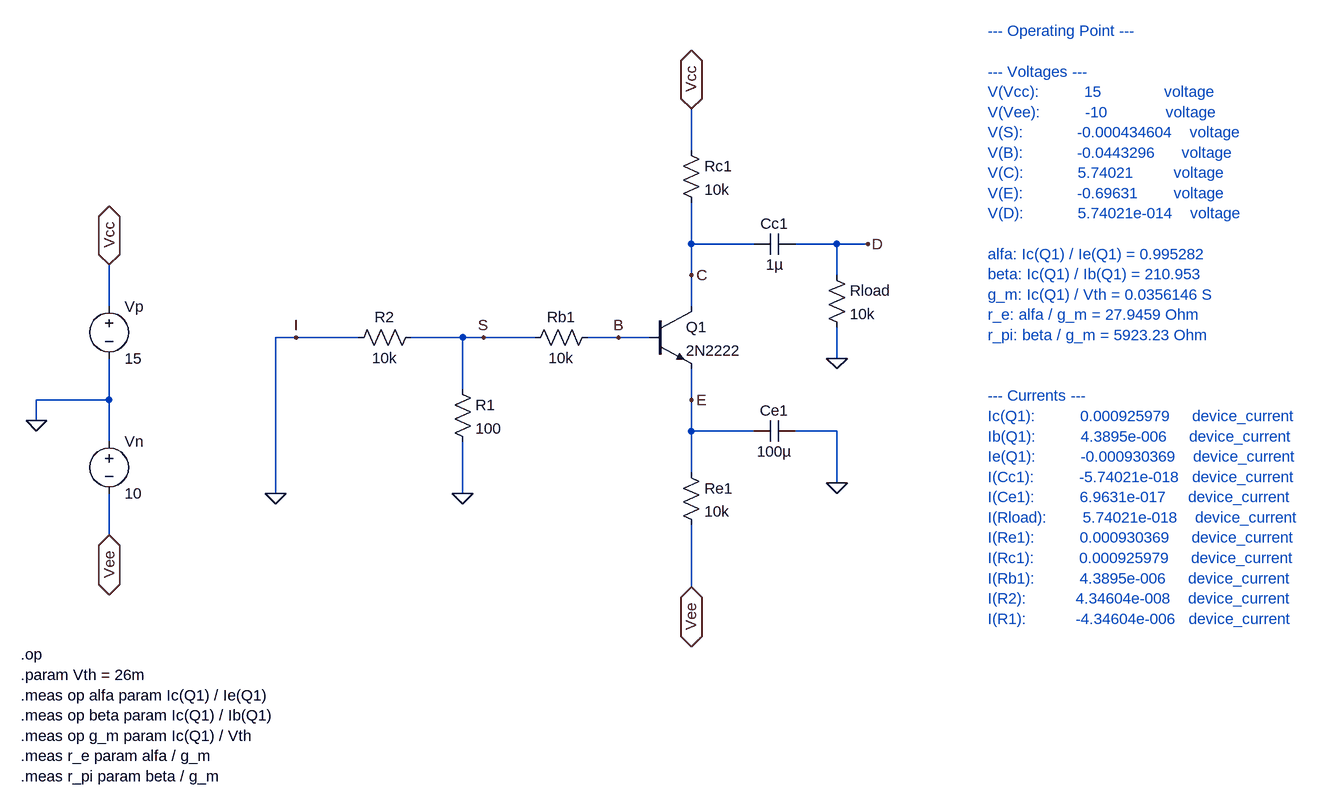
[diagram p0: schematic e1_1.asc]
e1_1.asc, the LTspice schematic file:
Version 4
SHEET 1 1912 784
WIRE 928 -176 928 -240
WIRE 928 -32 928 -96
WIRE 1024 -32 928 -32
WIRE 1152 -32 1088 -32
WIRE 1200 -32 1152 -32
WIRE 928 16 928 -32
WIRE 1152 16 1152 -32
WIRE 32 64 32 0
WIRE 928 64 928 16
WIRE 320 112 288 112
WIRE 416 112 320 112
WIRE 576 112 496 112
WIRE 608 112 576 112
WIRE 688 112 608 112
WIRE 816 112 768 112
WIRE 864 112 816 112
WIRE 1152 144 1152 96
WIRE 576 192 576 112
WIRE 32 208 32 144
WIRE 32 208 -80 208
WIRE 928 208 928 160
WIRE -80 240 -80 208
WIRE 928 256 928 208
WIRE 1024 256 928 256
WIRE 1152 256 1088 256
WIRE 32 272 32 208
WIRE 928 320 928 256
WIRE 1152 336 1152 256
WIRE 288 352 288 112
WIRE 576 352 576 272
WIRE 32 416 32 352
WIRE 928 496 928 400
FLAG -80 240 0
FLAG 32 0 Vcc
IOPIN 32 0 BiDir
FLAG 32 416 Vee
IOPIN 32 416 BiDir
FLAG 288 352 0
FLAG 576 352 0
FLAG 928 -240 Vcc
IOPIN 928 -240 BiDir
FLAG 928 496 Vee
IOPIN 928 496 BiDir
FLAG 1152 336 0
FLAG 320 112 I
FLAG 608 112 S
FLAG 816 112 B
FLAG 928 208 E
FLAG 928 16 C
FLAG 1152 144 0
FLAG 1200 -32 D
SYMBOL voltage 32 48 R0
SYMATTR InstName Vp
SYMATTR Value 15
SYMBOL voltage 32 256 R0
SYMATTR InstName Vn
SYMATTR Value 10
SYMBOL res 560 176 R0
SYMATTR InstName R1
SYMATTR Value 100
SYMBOL res 400 128 R270
WINDOW 0 32 56 VTop 2
WINDOW 3 0 56 VBottom 2
SYMATTR InstName R2
SYMATTR Value 10k
SYMBOL res 672 128 R270
WINDOW 0 32 56 VTop 2
WINDOW 3 0 56 VBottom 2
SYMATTR InstName Rb1
SYMATTR Value 10k
SYMBOL npn 864 64 R0
SYMATTR InstName Q1
SYMATTR Value 2N2222
SYMBOL res 912 -192 R0
SYMATTR InstName Rc1
SYMATTR Value 10k
SYMBOL res 912 304 R0
SYMATTR InstName Re1
SYMATTR Value 10k
SYMBOL cap 1088 240 R90
WINDOW 0 0 32 VBottom 2
WINDOW 3 32 32 VTop 2
SYMATTR InstName Ce1
SYMATTR Value 100µ
SYMBOL cap 1088 -48 R90
WINDOW 0 0 32 VBottom 2
WINDOW 3 32 32 VTop 2
SYMATTR InstName Cc1
SYMATTR Value 1µ
SYMBOL res 1136 0 R0
SYMATTR InstName Rload
SYMATTR Value 10k
TEXT -104 600 Left 2 !.op\n.param Vth = 26m\n.meas op alfa param Ic(Q1) / Ie(Q1)\n.meas op beta param Ic(Q1) / Ib(Q1)\n.meas op g_m param Ic(Q1) / Vth\n.meas r_e param alfa / g_m\n.meas r_pi param beta / g_m
TEXT 1384 -360 Left 2 ;--- Operating Point ---\n \n--- Voltages ---\nV(Vcc):          15              voltage\nV(Vee):          -10             voltage\nV(S):            -0.000434604    voltage\nV(B):            -0.0443296      voltage\nV(C):            5.74021         voltage\nV(E):            -0.69631        voltage\nV(D):            5.74021e-014    voltage\n \nalfa: Ic(Q1) / Ie(Q1) = 0.995282\nbeta: Ic(Q1) / Ib(Q1) = 210.953\ng_m: Ic(Q1) / Vth = 0.0356146 S\nr_e: alfa / g_m = 27.9459 Ohm\nr_pi: beta / g_m = 5923.23 Ohm\n \n \n--- Currents ---\nIc(Q1):          0.000925979     device_current\nIb(Q1):          4.3895e-006     device_current\nIe(Q1):          -0.000930369    device_current\nI(Cc1):          -5.74021e-018   device_current\nI(Ce1):          6.9631e-017     device_current\nI(Rload):        5.74021e-018    device_current\nI(Re1):          0.000930369     device_current\nI(Rc1):          0.000925979     device_current\nI(Rb1):          4.3895e-006     device_current\nI(R2):           4.34604e-008    device_current\nI(R1):           -4.34604e-006   device_current

The netlist it stands for:
* e1_1.asc
Vp Vcc 0 15
Vn 0 Vee 10
R1 S 0 100
R2 0 S 10k
Rb1 S B 10k
Q1 C B E 0 2N2222
Rc1 Vcc C 10k
Re1 E Vee 10k
Ce1 0 E 100µ
Cc1 D C 1µ
Rload D 0 10k
.model NPN NPN
.model PNP PNP
.lib standard.bjt
.op
.param Vth = 26m
.meas op alfa param Ic(Q1) / Ie(Q1)
.meas op beta param Ic(Q1) / Ib(Q1)
.meas op g_m param Ic(Q1) / Vth
.meas r_e param alfa / g_m
.meas r_pi param beta / g_m
* --- Operating Point ---
* --- Voltages ---
* V(Vcc):          15              voltage
* V(Vee):          -10             voltage
* V(S):            -0.000434604    voltage
* V(B):            -0.0443296      voltage
* V(C):            5.74021         voltage
* V(E):            -0.69631        voltage
* V(D):            5.74021e-014    voltage
* alfa: Ic(Q1) / Ie(Q1) = 0.995282
* beta: Ic(Q1) / Ib(Q1) = 210.953
* g_m: Ic(Q1) / Vth = 0.0356146 S
* r_e: alfa / g_m = 27.9459 Ohm
* r_pi: beta / g_m = 5923.23 Ohm
* --- Currents ---
* Ic(Q1):          0.000925979     device_current
* Ib(Q1):          4.3895e-006     device_current
* Ie(Q1):          -0.000930369    device_current
* I(Cc1):          -5.74021e-018   device_current
* I(Ce1):          6.9631e-017     device_current
* I(Rload):        5.74021e-018    device_current
* I(Re1):          0.000930369     device_current
* I(Rc1):          0.000925979     device_current
* I(Rb1):          4.3895e-006     device_current
* I(R2):           4.34604e-008    device_current
* I(R1):           -4.34604e-006   device_current
.backanno
.end